# Altium schematic sheet Sheet4.SchDoc
size A4
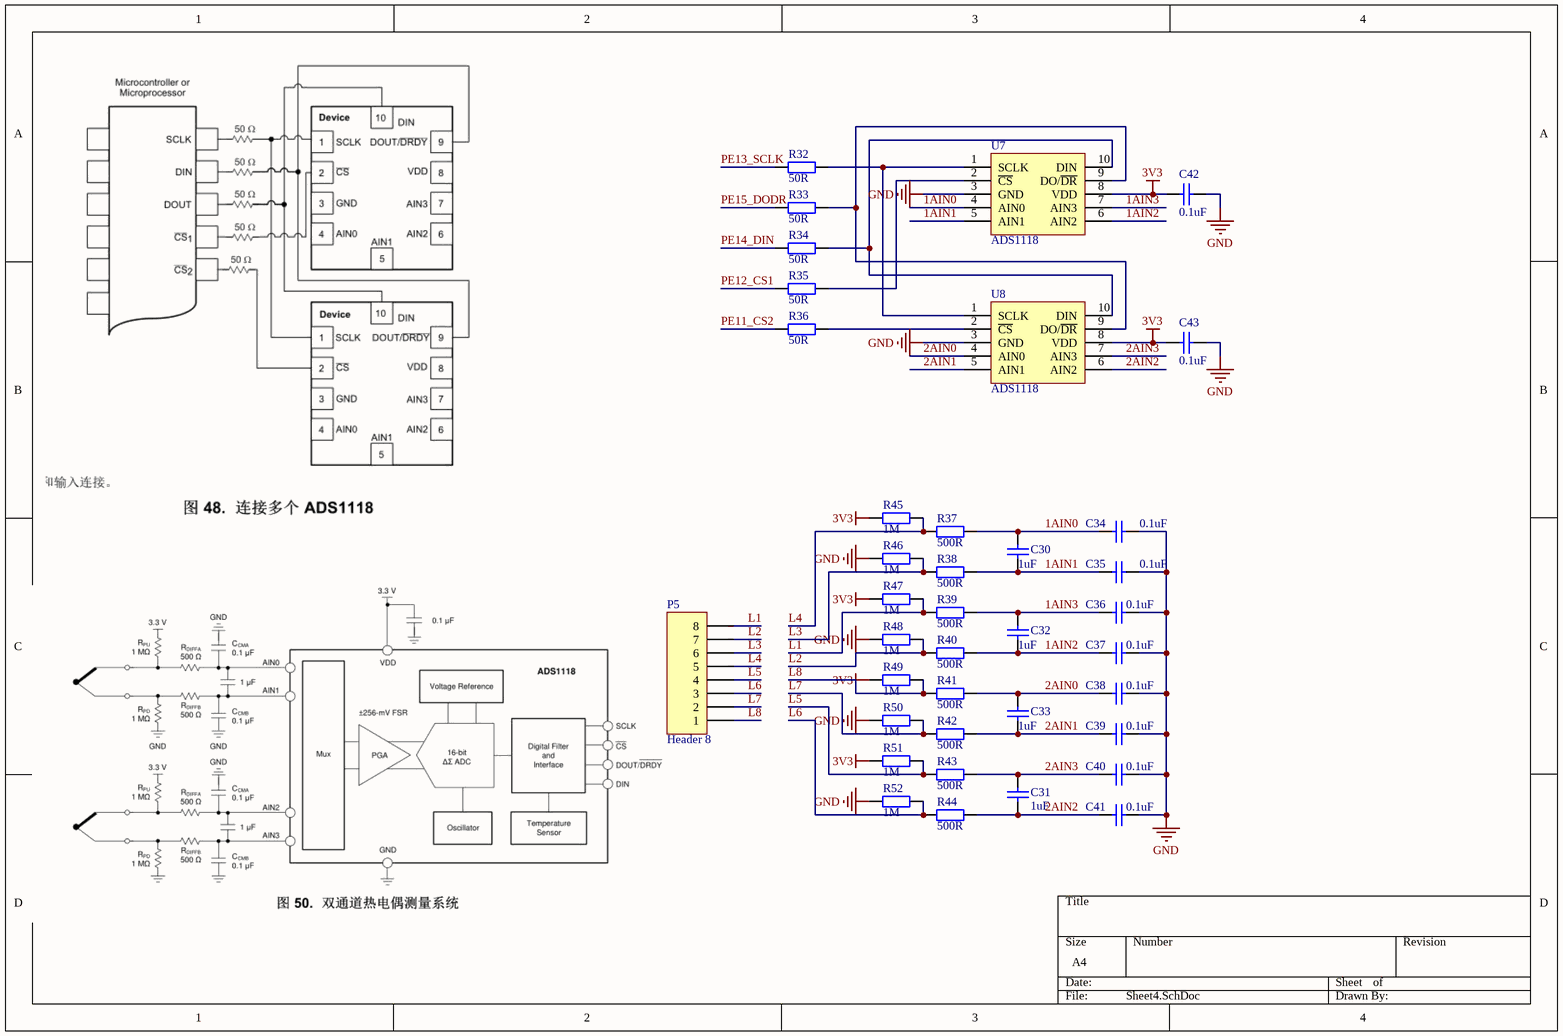
[diagram p0: Sheet4.SchDoc]

## Parts
C30  1uF  [LC-0603_C]
C31  1uF  [LC-0603_C]
C32  1uF  [LC-0603_C]
C33  1uF  [LC-0603_C]
C34  0.1uF  [LC-0603_C]
C35  0.1uF  [LC-0603_C]
C36  0.1uF  [LC-0603_C]
C37  0.1uF  [LC-0603_C]
C38  0.1uF  [LC-0603_C]
C39  0.1uF  [LC-0603_C]
C40  0.1uF  [LC-0603_C]
C41  0.1uF  [LC-0603_C]
C42  0.1uF  [LC-0603_C]
C43  0.1uF  [LC-0603_C]
P5  Header 8  [HDR1X8]
R32  50R  [LC-0603_R]
R33  50R  [LC-0603_R]
R34  50R  [LC-0603_R]
R35  50R  [LC-0603_R]
R36  50R  [LC-0603_R]
R37  500R  [LC-0603_R]
R38  500R  [LC-0603_R]
R39  500R  [LC-0603_R]
R40  500R  [LC-0603_R]
R41  500R  [LC-0603_R]
R42  500R  [LC-0603_R]
R43  500R  [LC-0603_R]
R44  500R  [LC-0603_R]
R45  1M  [LC-0603_R]
R46  1M  [LC-0603_R]
R47  1M  [LC-0603_R]
R48  1M  [LC-0603_R]
R49  1M  [LC-0603_R]
R50  1M  [LC-0603_R]
R51  1M  [LC-0603_R]
R52  1M  [LC-0603_R]
U7  ADS1118  [SOP-10]
U8  ADS1118  [SOP-10]

## Nets
3V3: C42.1 C43.1 R45.1 R47.1 R49.1 R51.1 U7.8(VDD) U8.8(VDD)
GND: C34.2 C35.2 C36.2 C37.2 C38.2 C39.2 C40.2 C41.2 C42.2 C43.2 R46.1 R48.1 R50.1 R52.1 U7.3(GND) U8.3(GND)
1AIN0: C30.2 C34.1 R37.2 U7.4(AIN0)
1AIN1: C30.1 C35.1 R38.2 U7.5(AIN1)
1AIN2: C32.1 C37.1 R40.2 U7.6(AIN2)
1AIN3: C32.2 C36.1 R39.2 U7.7(AIN3)
2AIN0: C33.2 C38.1 R41.2 U8.4(AIN0)
2AIN1: C33.1 C39.1 R42.2 U8.5(AIN1)
2AIN2: C31.1 C41.1 R44.2 U8.6(AIN2)
2AIN3: C31.2 C40.1 R43.2 U8.7(AIN3)
L1: P5.8 R39.1 R47.2
L2: P5.7 R40.1 R48.2
L3: P5.6 R38.1 R46.2
L4: P5.5 R37.1 R45.2
L5: P5.4 R43.1 R51.2
L6: P5.3 R44.1 R52.2
L7: P5.2 R42.1 R50.2
L8: P5.1 R41.1 R49.2
PE11_CS2: R36.1
PE12_CS1: R35.1
PE13_SCLK: R32.1
PE14_DIN: R34.1
PE15_DODR: R33.1
NetR32_2: R32.2 U7.1(SCLK) U8.1(SCLK)
NetR33_2: R33.2 U7.9(DO/~{DR}) U8.9(DO/~{DR})
NetR34_2: R34.2 U7.10(DIN) U8.10(DIN)
NetR35_2: R35.2 U7.2(~{CS})
NetR36_2: R36.2 U8.2(~{CS})

## Library data of the parts
C30-C43 = 0603 1uF (105) 10% 50V: 贴片电容; ComponentLink1Description: 供应商链接; ComponentLink1URL: http://www.szlcsc.com/product/details_16531.html; Package: 0603; Supplier: LC; SuppliersPartNumber: C15849
P5 = Header 8: Header, 8-Pin; LatestRevisionDate: 17-Jul-2002; LatestRevisionNote: Re-released for DXP Platform.; Publisher: Altium Limited
R32-R52 = 0603 1.5KΩ (1501) 1%: 贴片电阻; ComponentLink1Description: 供应商链接; ComponentLink1URL: http://www.szlcsc.com/product/details_23570.html; Package: 0603; Supplier: LC; SuppliersPartNumber: C22843
U7 U8 = ADS1118: AD采集芯片